# EAGLE design sensor_board (EAGLE 6.5.0)
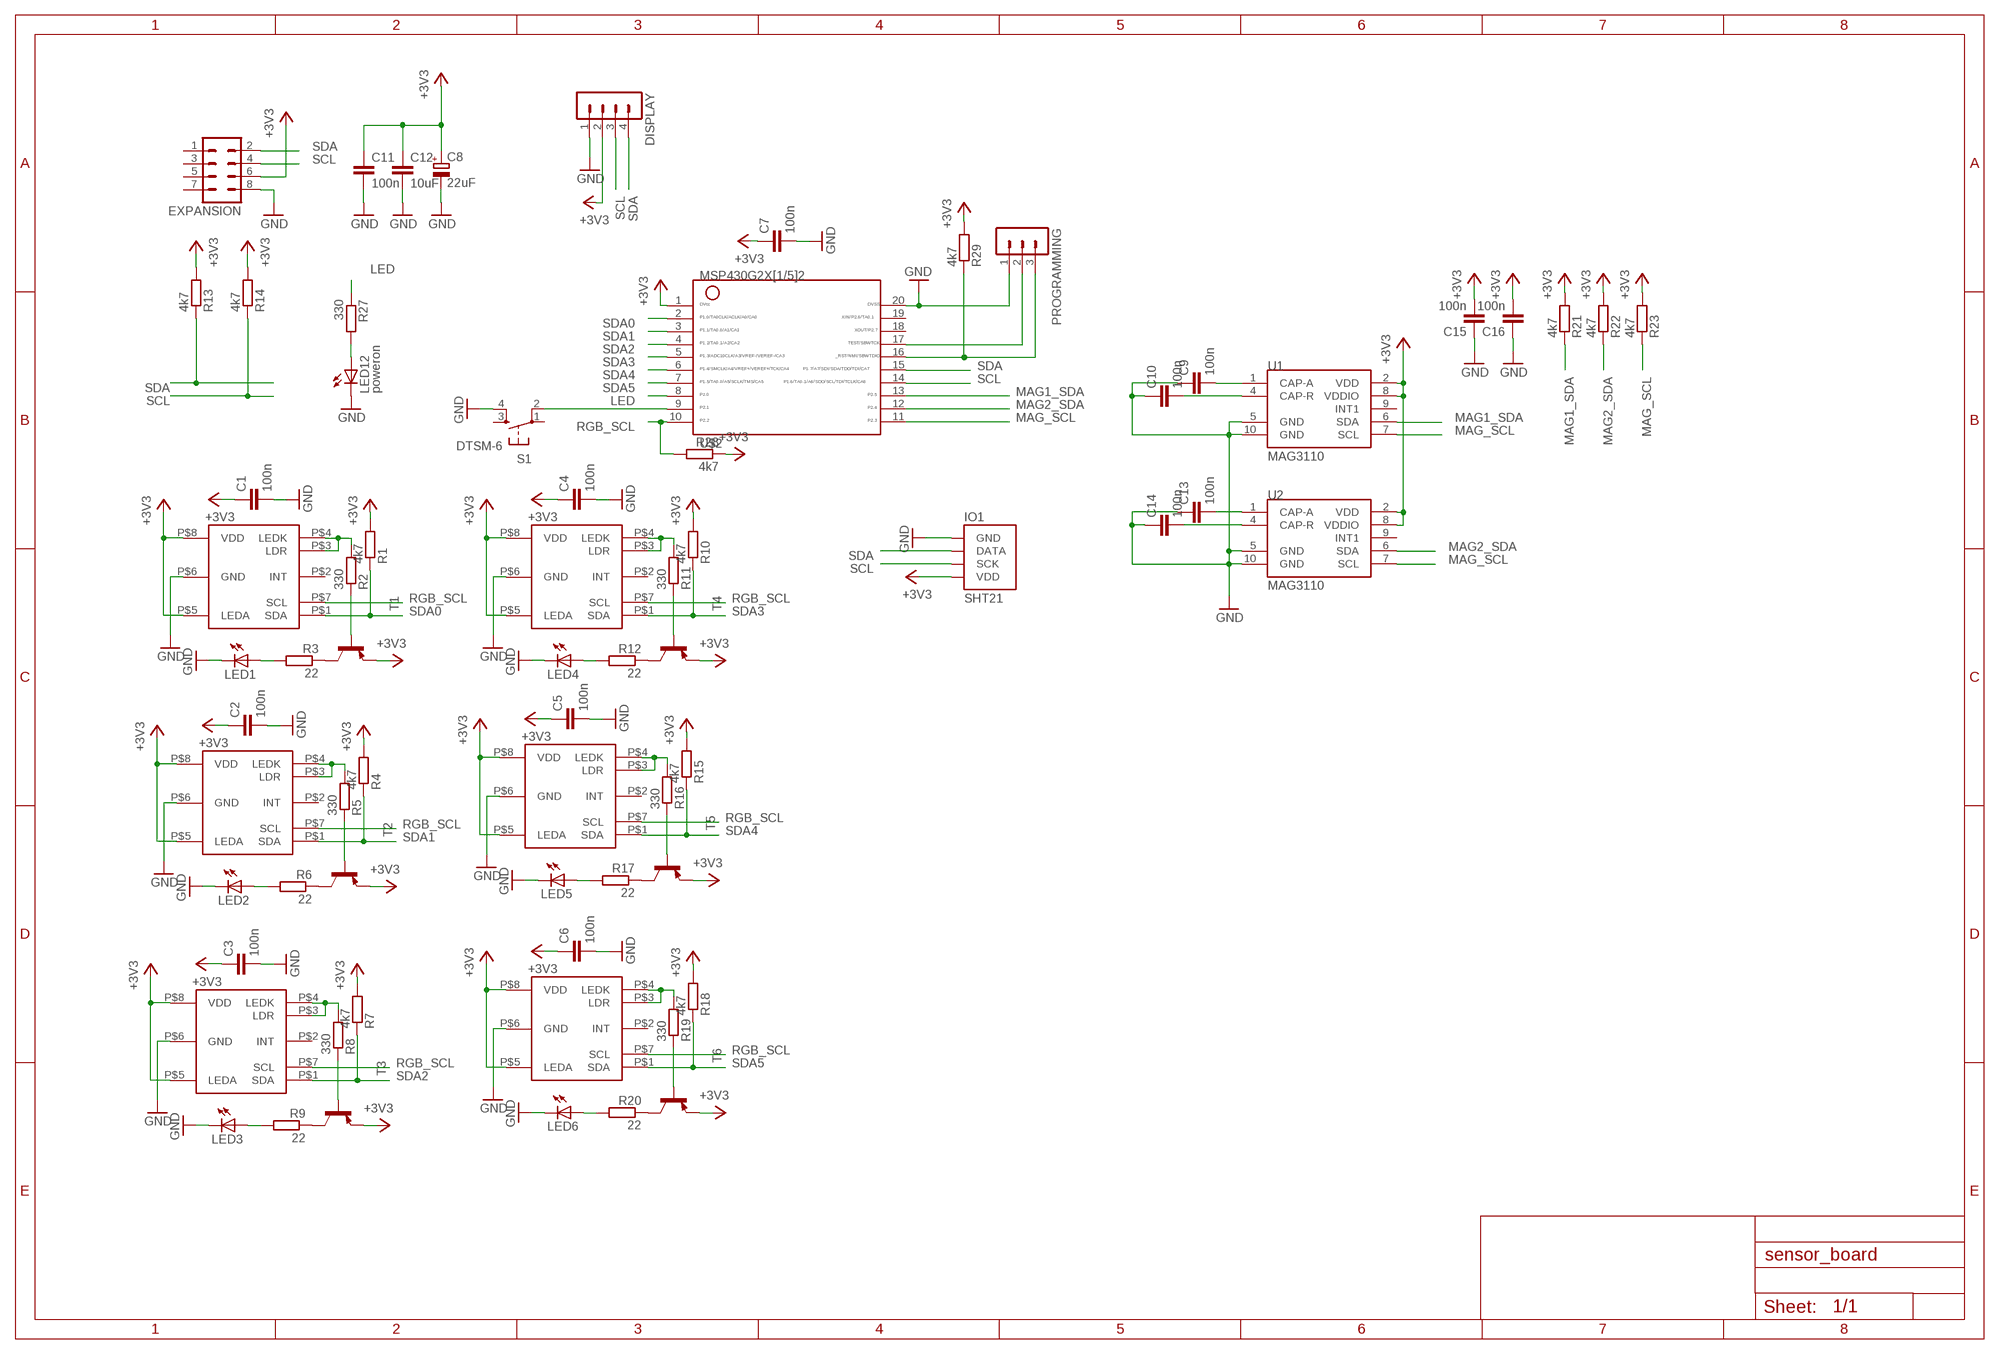
[diagram p0: schematic, sheet 1]

## Parts
C1  100n  C-EUC0805  [C0805]
C2  100n  C-EUC0805  [C0805]
C3  100n  C-EUC0805  [C0805]
C4  100n  C-EUC0805  [C0805]
C5  100n  C-EUC0805  [C0805]
C6  100n  C-EUC0805  [C0805]
C7  100n  C-EUC0805  [C0805]
C8  22uF  CPOL-EU153CLV-0505  [153CLV-0505]
C9  100n  C-EUC0805  [C0805]
C10  100n  C-EUC0805  [C0805]
C11  100n  C-EUC0805  [C0805]
C12  10uF  C-EUC0805  [C0805]
C13  100n  C-EUC0805  [C0805]
C14  100n  C-EUC0805  [C0805]
C15  100n  C-EUC0805  [C0805]
C16  100n  C-EUC0805  [C0805]
DISPLAY  MA04-1  [MA04-1]
EXPANSION  MA04-2  [MA04-2]
IO1  SHT21  [SHT2X]
LED1  LED5MM  [LED5MM]
LED2  LED5MM  [LED5MM]
LED3  LED5MM  [LED5MM]
LED4  LED5MM  [LED5MM]
LED5  LED5MM  [LED5MM]
LED6  LED5MM  [LED5MM]
LED12  poweron  LEDCHIPLED_1206  [CHIPLED_1206]
PROGRAMMING  MA03-1  [MA03-1]
R1  4k7  R-EU_M0805  [M0805]
R2  330  R-EU_M0805  [M0805]
R3  22  R-EU_M0805  [M0805]
R4  4k7  R-EU_M0805  [M0805]
R5  330  R-EU_M0805  [M0805]
R6  22  R-EU_M0805  [M0805]
R7  4k7  R-EU_M0805  [M0805]
R8  330  R-EU_M0805  [M0805]
R9  22  R-EU_M0805  [M0805]
R10  4k7  R-EU_M0805  [M0805]
R11  330  R-EU_M0805  [M0805]
R12  22  R-EU_M0805  [M0805]
R13  4k7  R-EU_M0805  [M0805]
R14  4k7  R-EU_M0805  [M0805]
R15  4k7  R-EU_M0805  [M0805]
R16  330  R-EU_M0805  [M0805]
R17  22  R-EU_M0805  [M0805]
R18  4k7  R-EU_M0805  [M0805]
R19  330  R-EU_M0805  [M0805]
R20  22  R-EU_M0805  [M0805]
R21  4k7  R-EU_M0805  [M0805]
R22  4k7  R-EU_M0805  [M0805]
R23  4k7  R-EU_M0805  [M0805]
R27  330  R-EU_M0805  [M0805]
R28  4k7  R-EU_M0805  [M0805]
R29  4k7  R-EU_M0805  [M0805]
S1  DTSM-6  [DTSM-6]
T1  BC857A-PNP-SOT23-BEC  [SOT23-BEC]
T2  BC857A-PNP-SOT23-BEC  [SOT23-BEC]
T3  BC857A-PNP-SOT23-BEC  [SOT23-BEC]
T4  BC857A-PNP-SOT23-BEC  [SOT23-BEC]
T5  BC857A-PNP-SOT23-BEC  [SOT23-BEC]
T6  BC857A-PNP-SOT23-BEC  [SOT23-BEC]
U1  MAG3110  [DFN-10]
U2  MAG3110  [DFN-10]
U$1  APDS9950_EDGE  [APDS9950_EDGE]
U$2  G2X[1/5]2---PW20  [PW20]
U$3  APDS9950_EDGE  [APDS9950_EDGE]
U$4  APDS9950_EDGE  [APDS9950_EDGE]
U$5  APDS9950_EDGE  [APDS9950_EDGE]
U$6  APDS9950_EDGE  [APDS9950_EDGE]
U$7  APDS9950_EDGE  [APDS9950_EDGE]

## Nets
+3V3: C1.1 C2.1 C3.1 C4.1 C5.1 C6.1 C7.1 C8.+ C11.1 C12.1 C15.2 C16.2 DISPLAY.2 EXPANSION.6 IO1.5(VDD) R1.2 R4.2 R7.2 R10.2 R13.2 R14.2 R15.2 R18.2 R21.2 R22.2 R23.2 R28.1 R29.2 T1.E T2.E T3.E T4.E T5.E T6.E U1.2(VDD) U1.8(VDDIO) U2.2(VDD) U2.8(VDDIO) U$1.P$5(LEDA) U$1.P$8(VDD) U$2.1 U$3.P$5(LEDA) U$3.P$8(VDD) U$4.P$5(LEDA) U$4.P$8(VDD) U$5.P$5(LEDA) U$5.P$8(VDD) U$6.P$5(LEDA) U$6.P$8(VDD) U$7.P$5(LEDA) U$7.P$8(VDD)
GND: C1.2 C2.2 C3.2 C4.2 C5.2 C6.2 C7.2 C8.- C9.1 C10.1 C11.2 C12.2 C13.1 C14.1 C15.1 C16.1 DISPLAY.1 EXPANSION.8 IO1.2(GND) LED1.K(C) LED2.K(C) LED3.K(C) LED4.K(C) LED5.K(C) LED6.K(C) LED12.C PROGRAMMING.1 S1.4 U1.5(GND) U1.10(GND) U2.5(GND) U2.10(GND) U$1.P$6(GND) U$2.20 U$3.P$6(GND) U$4.P$6(GND) U$5.P$6(GND) U$6.P$6(GND) U$7.P$6(GND)
LED: R27.1 U$2.8
MAG1_SDA: R21.1 U1.6(SDA) U$2.13
MAG2_SDA: R22.1 U2.6(SDA) U$2.12
MAG_SCL: R23.1 U1.7(SCL) U2.7(SCL) U$2.11
N$1: R2.2 U$1.P$3(LDR) U$1.P$4(LEDK)
N$2: PROGRAMMING.3 R29.1 U$2.16
N$3: PROGRAMMING.2 U$2.17
N$4: C10.2 U1.4(CAP-R)
N$5: C9.2 U1.1(CAP-A)
N$6: R2.1 T1.B
N$7: R3.1 T1.C
N$8: LED1.A R3.2
N$9: R5.2 U$3.P$3(LDR) U$3.P$4(LEDK)
N$13: R5.1 T2.B
N$14: R6.1 T2.C
N$15: LED2.A R6.2
N$16: R8.2 U$4.P$3(LDR) U$4.P$4(LEDK)
N$17: R8.1 T3.B
N$18: R9.1 T3.C
N$19: LED3.A R9.2
N$20: R11.2 U$5.P$3(LDR) U$5.P$4(LEDK)
N$21: R11.1 T4.B
N$22: R12.1 T4.C
N$23: LED12.A R27.2
N$24: LED4.A R12.2
N$25: R16.2 U$6.P$3(LDR) U$6.P$4(LEDK)
N$26: R16.1 T5.B
N$27: R17.1 T5.C
N$28: LED5.A R17.2
N$29: R19.2 U$7.P$3(LDR) U$7.P$4(LEDK)
N$30: R19.1 T6.B
N$31: R20.1 T6.C
N$32: LED6.A R20.2
N$34: S1.2 U$2.9
N$35: C13.2 U2.1(CAP-A)
N$37: C14.2 U2.4(CAP-R)
RGB_SCL: R28.2 U$1.P$7(SCL) U$2.10 U$3.P$7(SCL) U$4.P$7(SCL) U$5.P$7(SCL) U$6.P$7(SCL) U$7.P$7(SCL)
SCL: DISPLAY.3 EXPANSION.4 IO1.4(SCK) R14.1 U$2.14
SDA: DISPLAY.4 EXPANSION.2 IO1.1(DATA) R13.1 U$2.15
SDA0: R1.1 U$1.P$1(SDA) U$2.2
SDA1: R4.1 U$2.3 U$3.P$1(SDA)
SDA2: R7.1 U$2.4 U$4.P$1(SDA)
SDA3: R10.1 U$2.5 U$5.P$1(SDA)
SDA4: R15.1 U$2.6 U$6.P$1(SDA)
SDA5: R18.1 U$2.7 U$7.P$1(SDA)
Unconnected: EXPANSION.1 EXPANSION.3 EXPANSION.5 EXPANSION.7 S1.1 S1.3 U1.9(INT1) U2.9(INT1) U$1.P$2(INT) U$2.18 U$2.19 U$3.P$2(INT) U$4.P$2(INT) U$5.P$2(INT) U$6.P$2(INT) U$7.P$2(INT)

## Library data of the parts
C1-C7 C9-C16 = resistor:C-EU: CAPACITOR, European symbol
C8 = resistor:CPOL-EU: POLARIZED CAPACITOR, European symbol
DISPLAY = con-lstb:MA04-1: PIN HEADER; OC_FARNELL: unknown; OC_NEWARK: unknown
EXPANSION = con-lstb:MA04-2: PIN HEADER; OC_FARNELL: unknown; OC_NEWARK: unknown
IO1 = SparkFun-Sensors_03:SHT21
LED1-LED6 = my_parts:LED: LED OSRAM: - CHIPLED LG R971, LG N971, LY N971, LG Q971, LY Q971, LO R971, LY R971 LH N974, LH R974 LS Q976, LO Q976, LY Q976 LO Q996 - Hyper CHIPLED LW Q18S LB Q993, LB Q99A, LB R99A - SideLED LS A670, LO A670, LY A670, LG A670, LP A670 LB A673, LV A673, LT A673, LW A673 LH A674 LY A675 LS A676, LA A676, LO A676, LY A676, LW A676 LS A679, LY A679, LG A679 - Hyper Micro SIDELED® LS Y876, LA Y876, LO Y876, LY Y876 LT Y87S - SmartLED LW L88C, LW L88S LB L89C, LB L89S, LG L890 LS L89K, LO L89K, LY L89K LS L896, LA L896, LO L896, LY L896 - TOPLED LS T670, LO T670, LY T670, LG T670, LP T670 LSG T670, LSP T670, LSY T670, LOP T670, LYG T670 LG T671, LOG T671, LSG T671 LB T673, LV T673, LT T673, LW T673 LH T674 LS T676, LA T676, LO T676, LY T676, LB T676, LH T676, LSB T676, LW T676 LB T67C, LV T67C, LT T67C, LS T67K, LO T67K, LY T67K, LW E67C LS E67B, LA E67B, LO E67B, LY E67B, LB E67C, LV E67C, LT E67C LW T67C LS T679, LY T679, LG T679 LS T770, LO T770, LY T770, LG T770, LP T770 LB T773, LV T773, LT T773, LW T773 LH T774 LS E675, LA E675, LY E675, LS T675 LS T776, LA T776, LO T776, LY T776, LB T776 LHGB T686 LT T68C, LB T68C - Hyper Mini TOPLED® LB M676 - Mini TOPLED Santana® LG M470 LS M47K, LO M47K, LY M47K Source: http://www.osram.convergy.de LUXEON: - LUMILED® LXK2-PW12-R00, LXK2-PW12-S00, LXK2-PW14-U00, LXK2-PW14-V00 LXK2-PM12-R00, LXK2-PM12-S00, LXK2-PM14-U00 LXK2-PE12-Q00, LXK2-PE12-R00, LXK2-PE12-S00, LXK2-PE14-T00, LXK2-PE14-U00 LXK2-PB12-K00, LXK2-PB12-L00, LXK2-PB12-M00, LXK2-PB14-N00, LXK2-PB14-P00, LXK2-PB14-Q00 LXK2-PR12-L00, LXK2-PR12-M00, LXK2-PR14-Q00, LXK2-PR14-R00 LXK2-PD12-Q00, LXK2-PD12-R00, LXK2-PD12-S00 LXK2-PH12-R00, LXK2-PH12-S00 LXK2-PL12-P00, LXK2-PL12-Q00, LXK2-PL12-R00 Source: www.luxeon.com KINGBRIGHT: KA-3528ASYC Source: www.kingbright.com
LED12 = led:LED: LED OSRAM: - CHIPLED LG R971, LG N971, LY N971, LG Q971, LY Q971, LO R971, LY R971 LH N974, LH R974 LS Q976, LO Q976, LY Q976 LO Q996 - Hyper CHIPLED LW Q18S LB Q993, LB Q99A, LB R99A - SideLED LS A670, LO A670, LY A670, LG A670, LP A670 LB A673, LV A673, LT A673, LW A673 LH A674 LY A675 LS A676, LA A676, LO A676, LY A676, LW A676 LS A679, LY A679, LG A679 - Hyper Micro SIDELED® LS Y876, LA Y876, LO Y876, LY Y876 LT Y87S - SmartLED LW L88C, LW L88S LB L89C, LB L89S, LG L890 LS L89K, LO L89K, LY L89K LS L896, LA L896, LO L896, LY L896 - TOPLED LS T670, LO T670, LY T670, LG T670, LP T670 LSG T670, LSP T670, LSY T670, LOP T670, LYG T670 LG T671, LOG T671, LSG T671 LB T673, LV T673, LT T673, LW T673 LH T674 LS T676, LA T676, LO T676, LY T676, LB T676, LH T676, LSB T676, LW T676 LB T67C, LV T67C, LT T67C, LS T67K, LO T67K, LY T67K, LW E67C LS E67B, LA E67B, LO E67B, LY E67B, LB E67C, LV E67C, LT E67C LW T67C LS T679, LY T679, LG T679 LS T770, LO T770, LY T770, LG T770, LP T770 LB T773, LV T773, LT T773, LW T773 LH T774 LS E675, LA E675, LY E675, LS T675 LS T776, LA T776, LO T776, LY T776, LB T776 LHGB T686 LT T68C, LB T68C - Hyper Mini TOPLED® LB M676 - Mini TOPLED Santana® LG M470 LS M47K, LO M47K, LY M47K Source: http://www.osram.convergy.de LUXEON: - LUMILED® LXK2-PW12-R00, LXK2-PW12-S00, LXK2-PW14-U00, LXK2-PW14-V00 LXK2-PM12-R00, LXK2-PM12-S00, LXK2-PM14-U00 LXK2-PE12-Q00, LXK2-PE12-R00, LXK2-PE12-S00, LXK2-PE14-T00, LXK2-PE14-U00 LXK2-PB12-K00, LXK2-PB12-L00, LXK2-PB12-M00, LXK2-PB14-N00, LXK2-PB14-P00, LXK2-PB14-Q00 LXK2-PR12-L00, LXK2-PR12-M00, LXK2-PR14-Q00, LXK2-PR14-R00 LXK2-PD12-Q00, LXK2-PD12-R00, LXK2-PD12-S00 LXK2-PH12-R00, LXK2-PH12-S00 LXK2-PL12-P00, LXK2-PL12-Q00, LXK2-PL12-R00 Source: www.luxeon.com KINGBRIGHT: KA-3528ASYC Source: www.kingbright.com
PROGRAMMING = con-lstb:MA03-1: PIN HEADER; OC_FARNELL: unknown; OC_NEWARK: unknown
R1-R23 R27-R29 = resistor:R-EU_: RESISTOR, European symbol
S1 = switch-tact:DTSM-6
T1-T6 = my_parts:*-PNP-: PNP Transistror
U1 U2 = SparkFun-Sensors_03:MAG3110: 3-axis digital (I2C) magnetometer
U$1 U$3-U$7 = my_parts:APDS9950_EDGE
U$2 = my_parts:G2X[1/5]2---PW20: MSP430G2X[1/5]2 MSP430G2x52, MSP430G2x12 TSSOP (PW) 20 Pin Package http://focus.ti.com/docs/prod/folders/print/msp430g2452.html

## Board
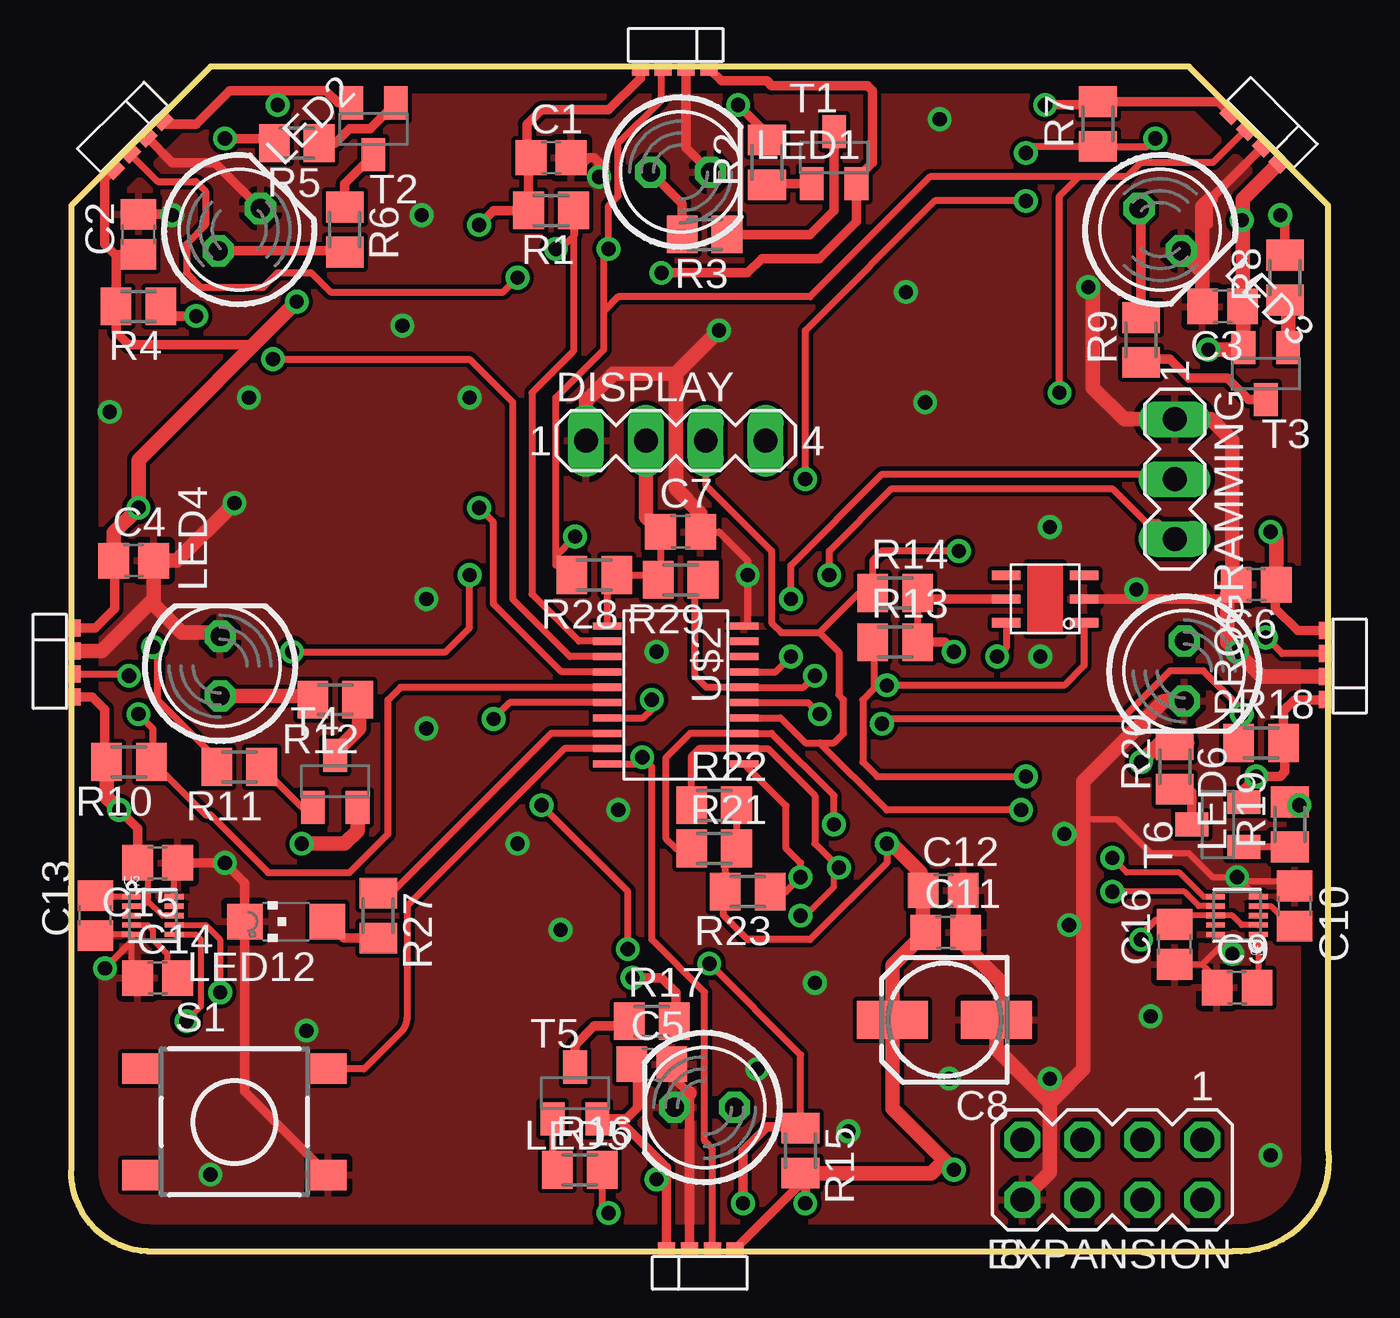
[diagram p1: board, top side]
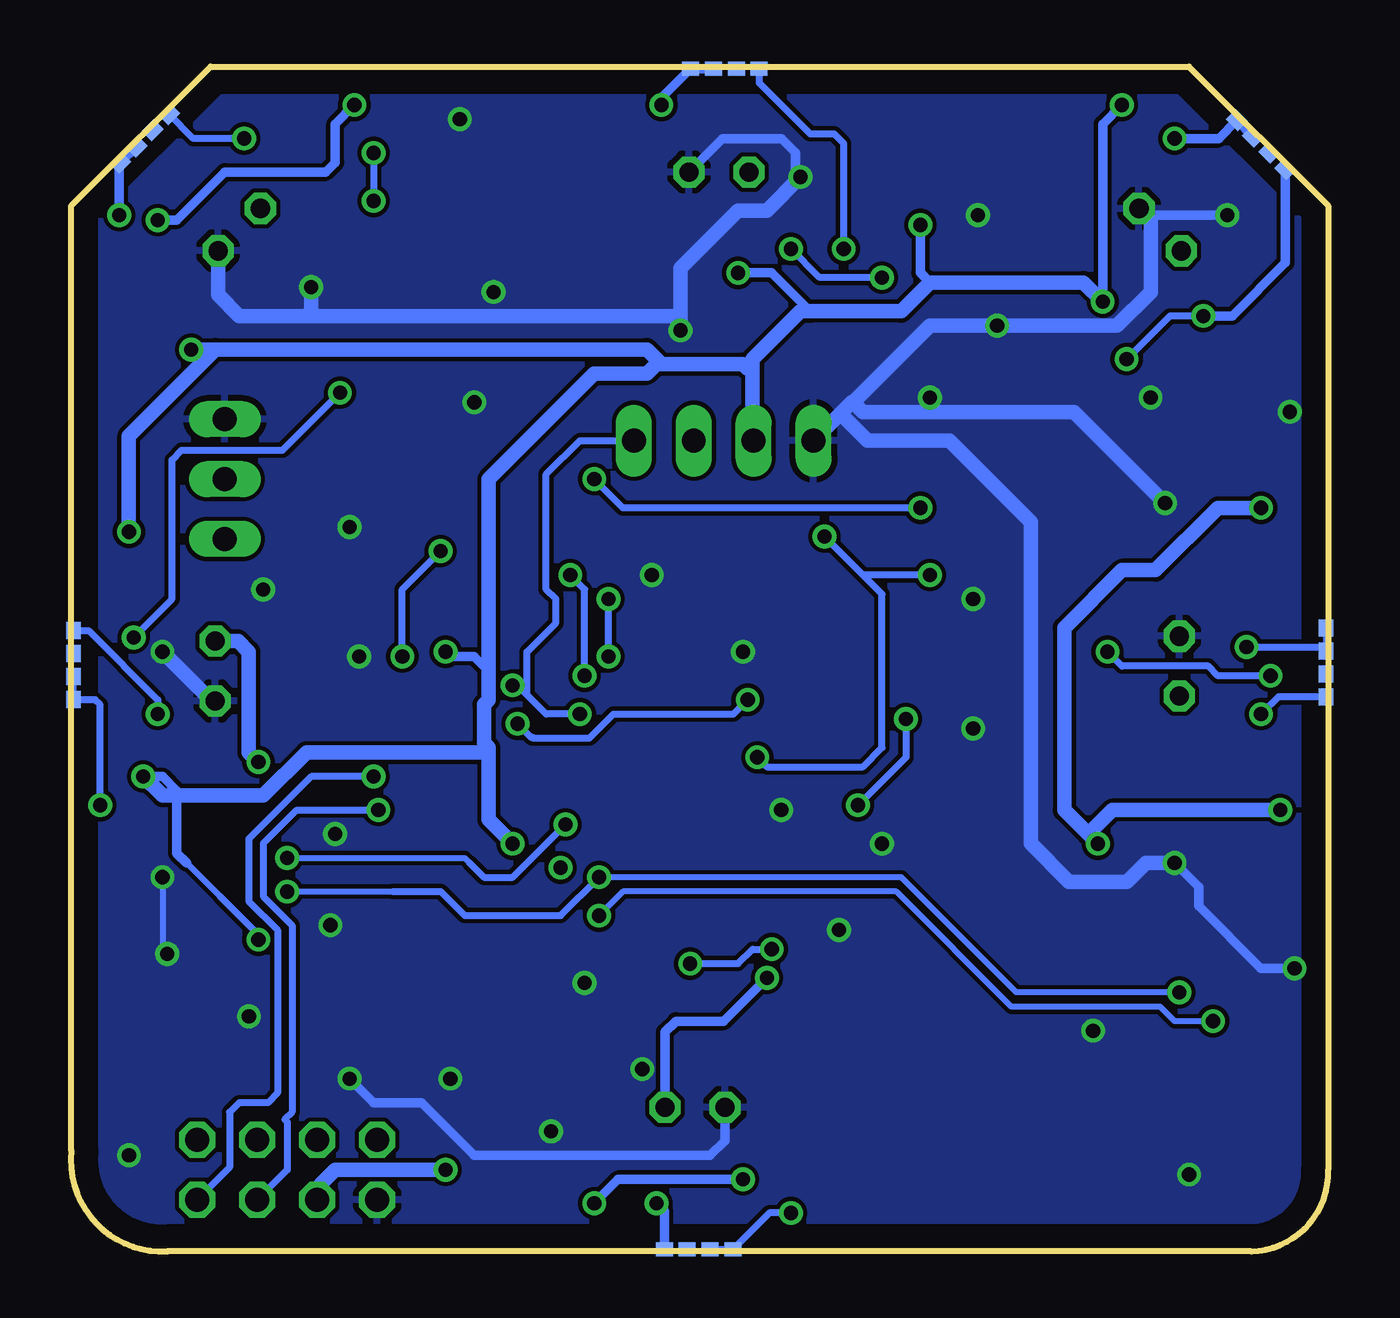
[diagram p2: board, bottom side, seen from below]

Size 53.26 x 50.19 mm. Coordinates in mm from the lower left corner, seen from the top.
Outline: 3.25,0 49.17,0 arc99 53.24,4.27 53.24,44.3 47.35,50.19 5.89,50.19 0,44.3 0,3.46 arc90 3.25,0
Copper layers (1*16): Top 0.035mm / dielectric 1.5mm / Bottom 0.035mm
Design rules "default *": minimum track width 7mil, minimum drill 24mil, track to track 7mil, track to pad 7mil, pad to pad 7mil, via to via 7mil, smd to smd 7mil, copper to edge 40mil, drill to drill 8mil, minimum pad ring 10mil, minimum via ring 8mil, stop-mask expansion 4mil, vias tented up to drill 0mil, thermal gap 10mil

### Footprints (pad centres in the part's own frame; a part is rotated, then mirrored left to right if it is on the bottom)
C0805 = smd 1.3 x 1.5: 1 -0.85,0; 2 0.85,0
153CLV-0505 = smd 3 x 1.6: + 2.2,0; - -2.2,0
MA04-1 = drill 1.016 long: 1 -3.81,0; 2 -1.27,0; 3 1.27,0; 4 3.81,0
MA04-2 = drill 1.016 octagon: 1 -3.81,-1.27; 2 -3.81,1.27; 3 -1.27,-1.27; 4 -1.27,1.27; 5 1.27,-1.27; 6 1.27,1.27; 7 3.81,-1.27; 8 3.81,1.27
SHT2X = smd 0.4 x 1.2: 1 1,1.65; 2 0,1.65; 3 -1,1.65; 4 1,-1.65; 5 0,-1.65; 6 -1,-1.65
LED5MM = drill 0.813 octagon: A -1.27,0; K 1.27,0
CHIPLED_1206 = smd 1.5 x 1.5: A 0,-1.75; C 0,1.75
MA03-1 = drill 1.016 long: 1 -2.54,0; 2 0,0; 3 2.54,0
M0805 = smd 1.3 x 1.6: 1 -0.95,0; 2 0.95,0
DTSM-6 = smd 1.55 x 1.3: 1 -3.975,2.25; 2 3.975,2.25; 3 -3.975,-2.25; 4 3.975,-2.25
SOT23-BEC = smd 1 x 1.4: B -0.95,-1.1; C 0,1.1; E 0.95,-1.1
DFN-10 = smd 0.8 x 0.22: 1 -0.91,0.8; 2 -0.91,0.4; 3 -0.91,0; 4 -0.91,-0.4; 5 -0.91,-0.8; 6 0.91,-0.8; 7 0.91,-0.4; 8 0.91,0; 9 0.91,0.4; 10 0.91,0.8
APDS9950_EDGE = smd 0.6 x 0.72 bottom: P$1 -0.9,1.5; P$2 -0.9,0.53; P$3 -0.9,-0.44; P$4 -0.9,-1.41 | smd 0.6 x 0.72: P$5 -0.9,-1.41; P$6 -0.9,-0.44; P$7 -0.9,0.53; P$8 -0.9,1.5
PW20 = smd 0.3 x 1.2: 1 -2.925,-2.9; 2 -2.275,-2.9; 3 -1.625,-2.9; 4 -0.975,-2.9; 5 -0.325,-2.9; 6 0.325,-2.9; 7 0.975,-2.9; 8 1.625,-2.9; 9 2.275,-2.9; 10 2.925,-2.9; 11 2.925,2.9; 12 2.275,2.9; 13 1.625,2.9; 14 0.975,2.9; 15 0.325,2.9; 16 -0.325,2.9; 17 -0.975,2.9; 18 -1.625,2.9; 19 -2.275,2.9; 20 -2.925,2.9

### Placement (x,y rotation side)
C1  20.32,46.33 0 top
C2  2.84,43.08 90 top
C3  48.77,40.03 180 top
C4  2.64,29.26 0 top
C5  24.59,7.93 0 top
C6  50.19,28.25 180 top
C7  25.81,30.48 0 top
C8  36.98,9.81 180 top
C9  49.38,11.18 0 top
C10  51.82,14.63 270 top
C11  37.03,13.52 0 top
C12  36.93,15.29 0 top
C13  1.02,14.23 90 top
C14  3.66,11.58 0 top
C15  3.66,16.46 180 top
C16  46.74,13.01 90 top
DISPLAY  25.6,34.34 0 top
EXPANSION  44.09,3.46 180 top
IO1  41.25,27.64 270 top
LED1  25.81,45.72 0 top
LED2  7.11,43.28 45 top
LED3  46.13,43.28 315 top
LED4  6.3,24.79 90 top
LED5  26.82,6.1 180 top
LED6  47.14,24.59 270 top
LED12  9.09,13.97 90 top
PROGRAMMING  46.74,32.72 270 top
R1  20.32,44.1 180 top
R2  29.46,46.13 90 top
R3  26.82,43.08 180 top
R4  2.84,40.03 180 top
R5  9.55,46.94 180 top
R6  11.58,43.28 270 top
R7  43.48,47.75 90 top
R8  51.41,41.25 90 top
R9  45.31,38.61 90 top
R10  2.44,20.73 180 top
R11  7.11,20.53 180 top
R12  11.18,23.37 180 top
R13  34.9,25.81 0 top
R14  34.9,27.89 0 top
R15  30.89,4.27 270 top
R16  21.54,3.46 0 top
R17  24.59,9.76 0 top
R18  50.39,21.54 0 top
R19  51.61,18.09 90 top
R20  46.74,20.53 90 top
R21  27.23,17.07 0 top
R22  27.23,18.9 0 top
R23  28.65,15.24 180 top
R27  13,14.23 270 top
R28  22.15,28.65 180 top
R29  25.81,28.45 180 top
S1  6.91,5.49 0 top
T1  32.31,46.33 0 top
T2  12.8,47.55 180 top
T3  50.6,37.19 180 top
T4  11.18,19.92 0 top
T5  21.34,6.71 0 top
T6  48.56,18.09 90 top
U1  49.38,14.23 180 top
U2  3.45,14.23 0 top
U$1  25.6,51.01 90 top
U$2  25.6,23.57 270 top
U$3  2.24,47.55 135 top
U$4  50.8,47.75 45 top
U$5  -0.81,25 180 top
U$6  26.62,-0.81 270 top
U$7  54.05,24.79 0 top

### Tracks (layer width: path | path; a pad name or v marks a point on that pad's centre or on a via)
+3V3  (via drill 0.6)
  Top 0.254: U2.2 3.04,14.63 3.25,14.84 | 3.25,14.84 3.25,16.02 C15.2 | U2.8 3.86,14.23 3.25,14.84 | U1.2 49.57,13.83 49.17,14.23 U1.8 47.11,14.23 C16.2
  Top 0.305: U$2.1 22.7,27.99 23.27,28.55 23.37,28.65 24.65,28.65 R29.2 24.96,28.55 C7.1 | R14.2 R13.2 | R22.2 R21.2 27.7,16.59 R23.2 27.64,15.18 27.64,14.23 28.65,13.21 31.29,13.21 34.54,16.46 v34.54,17.27 | v45.31,13.21 45.31,13.41 45.92,14.02 46.57,14.02 C16.2
  Top 0.406: U$1.P$8 24.1,49.71 22.76,48.36 19.91,48.36 19.3,47.75 19.3,46.5 C1.1 19.37,46.23 R1.2 17.88,44.1 v17.27,43.49 | v24.99,41.45 28.65,41.45 29.26,42.06 31.7,42.06 33.26,43.62 T1.E 33.26,45.45 33.93,46.13 33.93,49.18 33.73,49.38 29.67,49.38 29.46,49.58 27.54,49.58 U$1.P$5 | T2.E 11.3,48.65 10.77,49.18 8.74,49.18 | 8.74,49.18 6.71,49.18 5.28,47.75 4.03,47.75 U$3.P$5 | C2.1 1.87,42.23 | 1.87,42.23 1.42,42.67 1.42,45.47 U$3.P$8 | 1.87,42.23 1.89,42.2 R4.2 1.89,38.95 2.44,38.41 7.72,38.41 v9.55,40.24 | v8.74,48.57 8.74,49.18 | U$4.P$8 48.58,48.7 R7.2 43.35,48.57 v41.25,48.57 | U$4.P$5 51.16,46.08 49.58,44.5 v49.58,43.69 | U$5.P$8 0.89,23.5 1.42,22.96 1.42,20.79 R10.2 | U$5.P$5 1,26.41 1.83,27.23 1.83,29.23 C4.1 | U$7.P$8 51.94,26.29 51,27.23 51,28.21 C6.1 | T5.E 23.16,5.61 | 23.16,5.61 23.49,5.61 23.98,6.1 23.98,7.69 C5.1 | 23.16,5.61 25.21,3.56 U$6.P$5 25.21,2.63 v24.79,3.05 | U$6.P$8 30.89,2.86 R15.2 31.09,3.12 v31.09,2.03 | R13.2 36.98,25.81 v37.39,25.4 | 53.24,23.37 53.23,23.38 U$7.P$5 53.14,23.37 51.82,23.37 51.34,22.9 R18.2 51.41,21.48 51.41,20.32 51.21,20.12 v50.19,20.12 49.66,19.59 T6.E | IO1.5 36.1,27.64 R14.2 | C15.2 2.81,17.92 v2.03,18.7
  Top 0.61: DISPLAY.2 24.33,31.11 C7.1 | U$4.P$5 49.62,44.58 C3.1 49.65,40 T3.E | T3.E 49.26,38.29 | v48.16,38.2 49.56,38.2 T3.E | C4.1 1.79,30.44 v2.84,31.5 2.84,33.53 v9.55,40.24 | v9.75,17.27 11.58,17.27 12.13,17.82 T4.E | R10.2 1.49,19.24 v2.03,18.7 | C6.1 51.04,30.24 v50.8,30.48 | 36.98,3.86 34.78,6.06 C8.+ 34.78,12.11 C11.1 36.08,13.62 C12.1 35.97,15.41 35.97,16.05 34.75,17.27 v34.54,17.27 | 36.98,3.86 v37.39,3.46 | R28.1 23.16,28.65 23.27,28.55 | R15.2 36.44,3.32 36.98,3.86
  Bottom 0.254: 46.94,15.04 48.36,16.46
  Bottom 0.305: v45.31,13.21 45.31,13.41 46.94,15.04
  Bottom 0.406: v24.99,41.45 23.57,41.45 21.95,39.83 | v9.55,40.24 9.55,47.75 v8.74,48.57 | v49.58,43.69 48.77,43.69 46.74,45.72 42.47,45.72 42.06,46.13 42.06,47.75 v41.25,48.57 | 35.56,23.37 35.56,24.59 36.17,25.2 37.19,25.2 v37.39,25.4 | v17.27,43.49 17.27,41.45 16.87,41.05 | v24.79,3.05 30.07,3.05 v31.09,2.03 | v50.19,20.12 49.38,20.12 48.77,19.51 48.77,16.87 48.36,16.46
  Bottom 0.61: 24.38,37.59 24.38,37.8 22.35,39.83 21.95,39.83 18.08,39.83 16.87,41.05 10.36,41.05 v9.55,40.24 | 24.38,37.59 24.38,34.39 DISPLAY.2 | 24.38,37.59 24.59,37.39 24.79,37.59 28.24,37.59 28.35,37.7 | v48.16,38.2 47.14,38.2 | 47.14,38.2 28.85,38.2 28.35,37.7 | v2.84,31.5 4.67,31.5 7.32,28.86 8.74,28.86 11.18,26.42 11.18,18.7 10.16,17.68 | 10.16,17.68 v9.75,17.27 | v2.03,18.7 9.14,18.7 10.16,17.68 | v50.8,30.48 50.8,34.55 47.14,38.2 | v37.39,3.46 42.06,3.46 42.67,2.85 42.67,2.34 EXPANSION.6 | 28.35,37.7 28.85,37.19 31.09,37.19 35.56,32.72 35.56,23.37 35.76,23.17 35.76,21.54 35.56,21.34 35.56,21.13 | 35.56,21.13 35.56,18.29 v34.54,17.27 | 35.56,21.13 43.28,21.13 45.11,19.31 49.38,19.31 v50.19,20.12
GND  (via drill 0.6)
  Top 0.254: C13.1 1.07,13.43 U2.5 2.54,11.85 C14.1 | U2.10 4.36,16.32 C15.1 | U1.5 50.2,15.03 49.54,15.69 | v49.17,12.6 49.17,12.72 48.83,13.07 | 48.83,13.07 U1.10 | C16.1 47.92,12.16 | 47.92,12.16 48.83,13.07 | 42.88,18.29 44.3,18.29 45.72,16.87 47.35,16.87 48.36,15.85 v49.38,15.85 49.54,15.69 | C9.1 48.53,11.55 47.92,12.16 | 49.54,15.69 51.61,15.69 C10.1
  Top 0.305: C7.2 27.43,30.48 28.65,29.26 28.65,26.65 U$2.20 | U2.5 2.54,13.11 v1.42,11.99
  Top 0.406: U$1.P$6 26.04,46.76 LED1.K | U$3.P$6 3.18,47.21 4.27,46.13 6.06,46.13 LED2.K | C2.2 4.23,43.93 v4.27,43.89 | v22.35,45.52 22.35,46.13 22.15,46.33 21.91,46.33 21.54,45.96 | U$4.P$6 48.26,44.6 48.16,44.5 48.16,43.52 | C5.2 25.55,7.81 25.55,7.32 26.09,6.78 | U$6.P$6 26.18,6.69 26.09,6.78 | IO1.2 48.73,27.64 C6.2 | v41.45,7.32 41.45,6.71 41.66,6.5 | LED5.K 25.55,6.25 26.09,6.78 | S1.4 7.34,6.78 LED12.C 7.34,15.62 v6.5,16.46 C15.1
  Top 0.61: DISPLAY.1 21.79,36.02 22.96,37.19 25.6,37.19 | 25.6,37.19 v27.43,39.02 | 21.54,45.96 C1.2 | C7.2 26.66,31.26 25.6,32.31 25.6,37.19 | 48.26,44.6 47.92,44.26 C3.2 47.92,41.49 LED3.K | v43.08,40.85 43.28,40.64 43.28,36.58 44.6,35.26 PROGRAMMING.1 48.26,35.26 49.17,34.34 49.17,28.25 C6.2 48.97,27.88 48.97,25.81 v49.38,25.4 50.43,24.35 U$7.P$6 | 3.49,27.64 C4.2 4.47,29.26 v6.91,31.7 | 3.49,27.64 3.49,27.4 4.67,26.21 6.15,26.21 LED4.K | U$5.P$6 1.29,25.44 3.49,27.64 | LED6.K 46.28,23.32 42.88,19.92 42.88,18.29 42.88,7.72 41.66,6.5 41.45,6.3 | 41.45,6.3 41.45,3.35 EXPANSION.8 | C8.- 39.18,8.57 41.45,6.3 | 39.39,9.6 C8.- | C12.2 37.78,13.62 C11.2 37.88,12.92 39.42,11.38 39.42,10.04 C8.- | 26.18,6.69 26.14,6.69
  Bottom 0.254: v49.38,15.85 49.38,12.8 v49.17,12.6
  Bottom 0.406: LED1.K 25.65,47.14 23.16,47.14 22.56,46.53 22.56,45.72 v22.35,45.52 | v4.27,43.89 7.72,43.89 LED2.K | LED5.K 25.55,4.69 26.18,4.07 36.17,4.07 38.4,6.3 40.44,6.3 v41.45,7.32 | v1.42,11.99 2.84,11.99 5.49,14.63 5.49,15.45 v6.5,16.46
  Bottom 0.61: v27.43,39.02 27.43,39.63 | 27.43,39.63 27.43,41.66 24.99,44.1 23.77,44.1 v22.35,45.52 | LED2.K 7.52,43.69 7.52,40.64 8.94,39.22 16.87,39.22 20.12,35.97 | 20.12,35.97 20.17,35.97 20.65,35.49 | 20.65,35.49 DISPLAY.1 | LED3.K 47.02,40.52 46.13,39.63 42.88,39.63 | 42.88,39.63 27.43,39.63 | v43.08,40.85 43.08,39.83 42.88,39.63 | v6.91,31.7 10.77,35.56 19.71,35.56 20.12,35.97 | v6.5,16.46 7.72,16.46 8.53,15.65 10.97,15.65 12.6,17.27 12.6,30.89 16.05,34.34 19.51,34.34 20.65,35.49 | LED6.K 47.29,23.32 v49.38,25.4
  other vias: 1.63,35.56 14.83,43.89 14.02,39.22 36.78,47.96 35.36,40.64 36.17,35.97 15.04,27.64 15.04,22.15 5.89,3.25 37.19,7.32 28.65,28.65 41.05,25.2 41.45,30.69 16.87,36.17 31.5,11.38 20.73,13.62 18.9,17.27 24.79,25.4 42.27,13.82 42.06,17.68 45.72,9.96 9.96,9.35 23.16,18.7 29.06,7.72 32.92,5.08 50.8,4.07 45.11,28.04 7.52,36.17
  pour Top: -9.55,54.46 58.12,54.46 58.12,-8.33 -9.55,-8.33
  pour Bottom: -8.13,53.44 62.38,53.44 62.38,-2.84 -8.13,-2.84
  pour Bottom: -10.57,52.02 59.94,52.02 59.94,-4.26 -10.57,-4.26
LED
  Top 0.305: U$2.8 20.32,21.95 13.55,15.18 R27.1
MAG1_SDA  (via drill 0.6)
  Top 0.254: U1.6 47.97,15.03 46.94,16.05 44.7,16.05 v44.09,16.66
  Top 0.305: v32.31,18.09 32.31,19.31 29.67,21.95 U$2.13 26.21,21.95 25.2,20.93 25.2,17.48 25.6,17.07 R21.1
  Bottom 0.254: v44.09,16.66 36.58,16.66 36.37,16.46
  Bottom 0.305: 36.37,16.46 35.76,15.85 34.54,15.85 v32.31,18.09
MAG2_SDA  (via drill 0.6)
  Top 0.254: U2.6 5.27,13.43 5.49,13.21 5.49,10.37 v4.88,9.76 | v30.89,14.23 31.09,14.23 32.31,15.45 32.31,16.05 v32.51,16.26
  Top 0.305: v32.51,16.26 31.5,17.27 31.5,19.31 29.5,21.3 U$2.12 26.58,21.3 26.28,21 R22.1
  Bottom 0.254: v4.88,9.76 6.5,9.76 7.11,10.37 13.41,10.37 18.29,15.24 29.87,15.24 v30.89,14.23
MAG_SCL  (via drill 0.6)
  Top 0.254: U2.7 5.68,13.83 6.3,13.21 v6.3,10.97 | U1.7 47.76,14.63 47.14,15.24 v44.09,15.24
  Top 0.305: U$2.11 30.28,18.87 30.28,17.07 30.89,16.46 v30.89,15.85 30.28,15.24 R23.1
  Bottom 0.254: v6.3,10.97 13.21,10.97 18.08,15.85 v30.89,15.85 | v44.09,15.24 39.42,15.24
  Bottom 0.305: 39.62,15.24 39.42,15.24 37.59,15.24 36.58,14.23 32.51,14.23 v30.89,15.85
N$1  (via drill 0.6)
  Top 0.406: R2.2 29.46,47.35 v28.24,48.57
  Bottom 0.406: U$1.P$3 U$1.P$4 28.24,48.87 v28.24,48.57
N$2  (via drill 0.6)
  Top 0.305: R29.1 26.42,28.11 26.42,24.39 26.9,23.9 U$2.16 31.01,23.9 v31.5,24.39 | v32.11,28.65 32.11,29.67 34.75,32.31 44.09,32.31 45.52,30.89 46.02,30.89 PROGRAMMING.3
  Bottom 0.305: v31.5,24.39 31.5,28.04 v32.11,28.65
N$3  (via drill 0.6)
  Top 0.305: U$2.17 29.83,24.55 v30.48,25.2 | v30.48,27.64 30.48,29.06 34.34,32.92 46.53,32.92 PROGRAMMING.2
  Bottom 0.305: v30.48,25.2 v30.48,27.64
N$4
  Top 0.254: U1.4 50.81,14.63 51.21,14.23 51.37,14.23 C10.2
N$5
  Top 0.254: U1.1 50.29,11.24 C9.2
N$6
  Top 0.406: T1.B 29.52,45.23 R2.1
N$7
  Top 0.406: R3.1 31.29,43.08 32.31,44.1 T1.C
N$8
  Top 0.406: R3.2 25.87,44.39 LED1.A
N$9  (via drill 0.6)
  Top 0.406: v6.5,47.14 8.4,47.14 R5.2
  Bottom 0.406: v6.5,47.14 4.64,47.14 U$3.P$4 U$3.P$3
N$13
  Top 0.406: T2.B 12.65,47.55 11.79,47.55 11.18,46.94 R5.1
N$14
  Top 0.406: R6.1 11.58,45.23 T2.C
N$15
  Top 0.406: LED2.A 11.53,42.39 R6.2
N$16  (via drill 0.6)
  Top 0.406: R8.2 51.41,43.69 v51.21,43.89
  Bottom 0.406: U$4.P$3 U$4.P$4 51.21,46.07 v51.21,43.89
N$17
  Top 0.61: T3.B 51.55,40.16 R8.1
N$18
  Top 0.406: T3.C 49.87,36.09 48.97,36.98 47.35,36.98 46.53,37.8 45.45,37.8 R9.1
N$19
  Top 0.406: R9.2 45.31,44.1 LED3.A
N$20  (via drill 0.6)
  Top 0.305: R11.2 6.16,20.87 3.66,23.37 3.66,25.4 v3.45,25.61
  Bottom 0.305: v3.45,25.61 0.26,25.61 U$5.P$3 U$5.P$4
N$21
  Top 0.305: T4.B 9.77,18.82 R11.1
N$22
  Top 0.61: T4.C 11.18,21.13 12.19,22.15 12.19,23.3 R12.1
N$23
  Top 0.406: R27.2 11.54,13.28 LED12.A
N$24
  Top 0.61: LED4.A 10.07,23.52 R12.2
N$25  (via drill 0.6)
  Top 0.305: R16.2 22.49,1.9 v22.76,1.63
  Bottom 0.305: v22.76,1.63 23.67,1.63 U$6.P$4 U$6.P$3
N$26
  Top 0.305: T5.B 20.39,3.66 R16.1
N$27
  Top 0.406: T5.C 21.34,8.74 22.15,9.55 23.43,9.55 R17.1
N$28  (via drill 0.6)
  Top 0.406: v23.77,11.58 24.99,11.58 25.6,10.97 25.6,9.82 R17.2
  Bottom 0.406: LED5.A 28.09,9.3 27.64,9.76 25.6,9.76 v23.77,11.58
N$29  (via drill 0.6)
  Top 0.305: R19.2 51.61,18.49 v52.02,18.9
  Bottom 0.305: v52.02,18.9 52.02,23.17 52.22,23.37 53.14,23.37 U$7.P$4 U$7.P$3
N$30
  Top 0.305: R19.1 T6.B
N$31
  Top 0.406: T6.C 47.46,19.46 R20.1
N$32  (via drill 0.6)
  Top 0.61: v45.31,20.73 46.13,21.54 47.28,21.54 R20.2
  Bottom 0.61: LED6.A 46.18,25.86 45.72,25.4 45.72,21.13 v45.31,20.73
N$34
  Top 0.305: U$2.9 20.89,21.3 14.22,14.63 14.22,9.97 arc-45 13.93,9.26 12.4,7.72 10.92,7.72 arc-45 S1.2
N$35
  Top 0.254: U2.1 1.07,15.03 C13.2
N$37
  Top 0.254: U2.4 3.24,13.83 3.45,13.62 3.45,13.21 4.06,12.6 4.06,12.03 C14.2
RGB_SCL  (via drill 0.6)
  Top 0.305: 2.64,46.54 2.64,46.34 3.66,45.32 5.28,45.32 5.69,44.91 5.69,43.49 4.88,42.67 4.88,41.45 5.49,40.85 8.13,40.85 8.74,41.45 10.16,41.45 10.97,40.64 18.29,40.64 v18.9,41.25 | U$1.P$7 24.99,50.03 24.99,48.77 23.16,46.94 23.16,44.71 22.76,44.3 v22.76,42.47 22.56,42.27 22.56,39.83 | U$2.10 23.9,20.65 v24.18,20.93 24.59,20.53 24.59,13.21 26.82,10.97 26.82,4.68 27.15,4.35 U$6.P$7 | 20.52,29.06 20.52,29.26 | 20.52,29.47 20.52,36.17 22.56,38.2 22.56,39.83 | U$4.P$7 49.73,47.49 48.36,46.13 45.31,46.13 44.7,45.52 42.67,45.52 | 42.67,45.52 36.37,45.52 31.29,40.44 23.16,40.44 22.56,39.83 | U$5.P$7 2.36,24.47 v2.44,24.39 | v9.35,25.4 15.85,25.4 16.87,26.42 v16.87,28.65 | R28.2 21.13,28.65 20.52,29.26 | 20.52,29.26 20.52,29.47 | 20.52,29.47 v21.34,30.28 | U$7.P$7 51.29,25.32 v50.6,26.01 | v41.86,36.37 41.86,44.71 42.67,45.52
  Top 0.406: U$3.P$7 2.64,46.54
  Bottom 0.305: v18.9,41.25 21.54,41.25 v22.76,42.47 | v2.44,24.39 4.67,24.39 5.08,24.79 8.74,24.79 v9.35,25.4 | v24.18,20.93 23.77,20.53 19.71,20.53 18.9,21.34 18.9,27.84 19.71,28.65 | v16.87,28.65 19.71,28.65 | 19.71,28.65 v21.34,30.28 | v50.6,26.01 48.97,27.64 48.97,33.53 48.56,33.94 44.3,33.94 v41.86,36.37
SCL  (via drill 0.6)
  Top 0.305: DISPLAY.3 26.87,32.46 29.67,29.67 29.67,26.62 30.07,26.21 31.7,26.21 | 31.7,26.21 32.51,25.4 32.51,23.57 32.72,23.37 32.72,21.95 32.31,21.54 31.7,21.54 | U$2.14 30.03,22.6 31.09,21.54 31.7,21.54 | 31.7,26.21 33.3,27.82 arc-45 33.48,27.89 R14.1 33.93,27.91 33.93,29.26 34.34,29.67 v37.59,29.67 | v40.23,18.7 34.54,18.7 31.7,21.54 | IO1.4 39.6,25.58 v39.22,25.2
  Bottom 0.305: EXPANSION.4 44.09,3.46 44.09,5.49 44.2,5.59 43.89,5.89 43.89,13.82 45.11,15.04 45.11,17.27 43.69,18.7 v40.23,18.7 | v39.22,25.2 39.22,28.04 v37.59,29.67
SDA  (via drill 0.6)
  Top 0.305: U$2.15 31.21,23.25 v31.7,22.76 | 34.02,23.87 33.53,23.37 33.53,20.73 34.14,20.12 v40.44,20.12 | 34.02,23.87 34.02,25.73 R13.1 | 34.02,23.87 34.43,23.87 v34.54,23.98 42.06,23.98 42.9,24.82 IO1.1
  Bottom 0.305: v31.7,22.76 33.12,22.76 33.93,23.57 | 33.93,23.57 33.93,25.4 32.72,26.62 32.72,27.64 33.12,28.04 33.12,32.92 31.7,34.34 DISPLAY.4 | v34.54,23.98 34.34,23.98 33.93,23.57 | EXPANSION.2 46.53,3.56 46.53,5.89 46.13,6.3 44.91,6.3 44.5,6.71 44.5,13.62 45.72,14.84 45.72,17.48 43.08,20.12 v40.44,20.12
SDA0  (via drill 0.6)
  Top 0.305: v20.52,42.47 20.73,42.47 21.34,43.08 21.34,44.03 R1.1 21.27,38.14 19.51,36.37 19.51,27.84 21.5,25.85 U$2.2
  Bottom 0.305: U$1.P$1 24.1,49.51 21.95,47.35 20.93,47.35 20.52,46.94 v20.52,42.47
SDA1  (via drill 0.6)
  Top 0.305: v8.53,37.8 16.87,37.8 18.69,35.97 18.69,27.64 21.13,25.2 U$2.3
  Top 0.406: v5.28,39.63 4.2,39.63 R4.1 3.79,39.9 3.86,39.83
  Bottom 0.305: v5.28,39.63 6.71,39.63 v8.53,37.8
  Bottom 0.406: U$3.P$1 1.81,41.88 4.06,39.63 v5.28,39.63
SDA2  (via drill 0.6)
  Top 0.305: v45.92,47.14 45.58,46.8 R7.1 40.71,46.8 v40.44,46.53 | v40.44,44.5 36.58,44.5 31.09,39.02 v31.09,32.72 | U$2.4 20.77,24.55 17.88,27.43 17.88,30.89 v17.27,31.5
  Bottom 0.305: v45.92,47.14 48.07,47.14 U$4.P$1 | v40.44,46.53 v40.44,44.5 | v17.27,31.5 29.87,31.5 v31.09,32.72
SDA3  (via drill 0.6)
  Top 0.305: v2.84,22.76 3.45,22.15 3.45,20.79 R10.1 3.45,20.73 5.69,18.49 5.89,18.49 8.33,16.05 11.79,16.05 13.41,17.68 13.41,23.37 13.94,23.9 U$2.5
  Bottom 0.305: U$5.P$1 2.11,23.5 v2.84,22.76
SDA4  (via drill 0.6)
  Top 0.305: U$2.6 18.57,23.25 v17.88,22.56 | R15.1 30.89,8.33 v27.03,12.19 | v23.57,12.8 23.57,15.24 v19.91,18.9
  Top 0.406: R15.1 30.82,5.29 29.46,5.29 28.45,4.27 v28.45,2.03
  Bottom 0.305: v17.88,22.56 17.88,20.93 v19.91,18.9 | v27.03,12.19 24.99,12.19 24.38,12.8 v23.57,12.8
  Bottom 0.406: U$6.P$1 28.12,1.71 v28.45,2.03
SDA5  (via drill 0.6)
  Top 0.305: v49.58,22.76 49.58,20.87 R18.1 49.44,23.1 47.96,24.59 46.53,24.59 44.5,22.56 34.54,22.56 v34.34,22.35 | v24.59,23.37 24.59,22.96 24.22,22.6 U$2.7
  Bottom 0.305: U$7.P$1 52.5,26.29 49.58,23.37 v49.58,22.76 | v24.59,23.37 25.2,22.76 30.28,22.76 31.29,21.74 33.63,21.74 arc45 33.81,21.82 v34.34,22.35